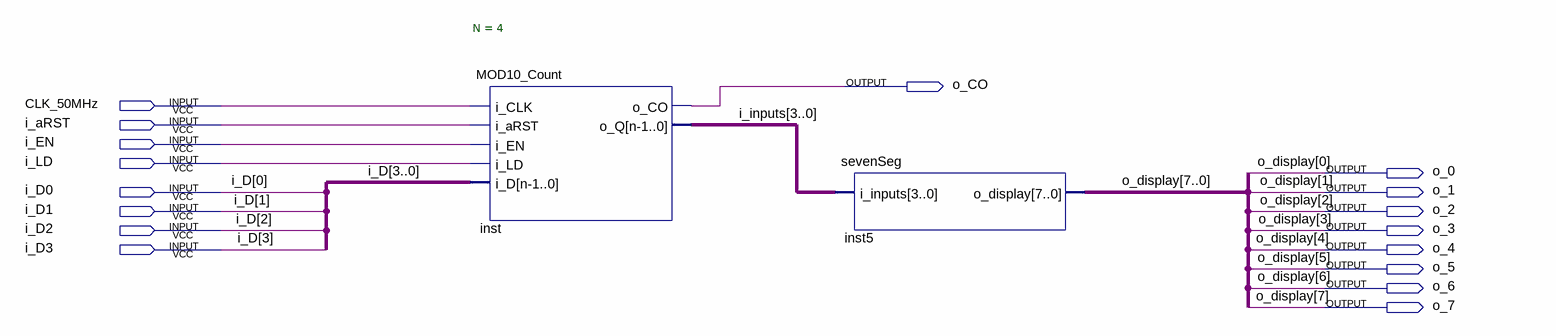
[diagram p0: schematic sheet]
// Quartus schematic MOD10_Counter.bdf as structural Verilog: 2 symbols, 17 pins
module MOD10_Counter (
  input  CLK_50MHz,
  input  i_aRST,
  input  i_EN,
  input  i_LD,
  input  i_D0,
  input  i_D1,
  input  i_D2,
  input  i_D3,
  output o_CO,
  output o_0,
  output o_1,
  output o_2,
  output o_3,
  output o_4,
  output o_5,
  output o_6,
  output o_7
);

  wire [3:0] i_inputs;

  MOD10_Count #(.N(4)) inst (
    .i_CLK(CLK_50MHz), .i_aRST(i_aRST), .i_EN(i_EN), .i_LD(i_LD), .i_D({i_D3, i_D2, i_D1, i_D0}),
    .o_CO(o_CO), .o_Q(i_inputs));
  sevenSeg inst5 (.i_inputs(i_inputs), .o_display({o_7, o_6, o_5, o_4, o_3, o_2, o_1, o_0}));

  // Other names for the same wires on the sheet: o_display[7:0] = {o_7, o_6, o_5, o_4, o_3, o_2, o_1, o_0}
endmodule
